# EAGLE design picostepseq_mk2_16a (EAGLE 9.6.2)
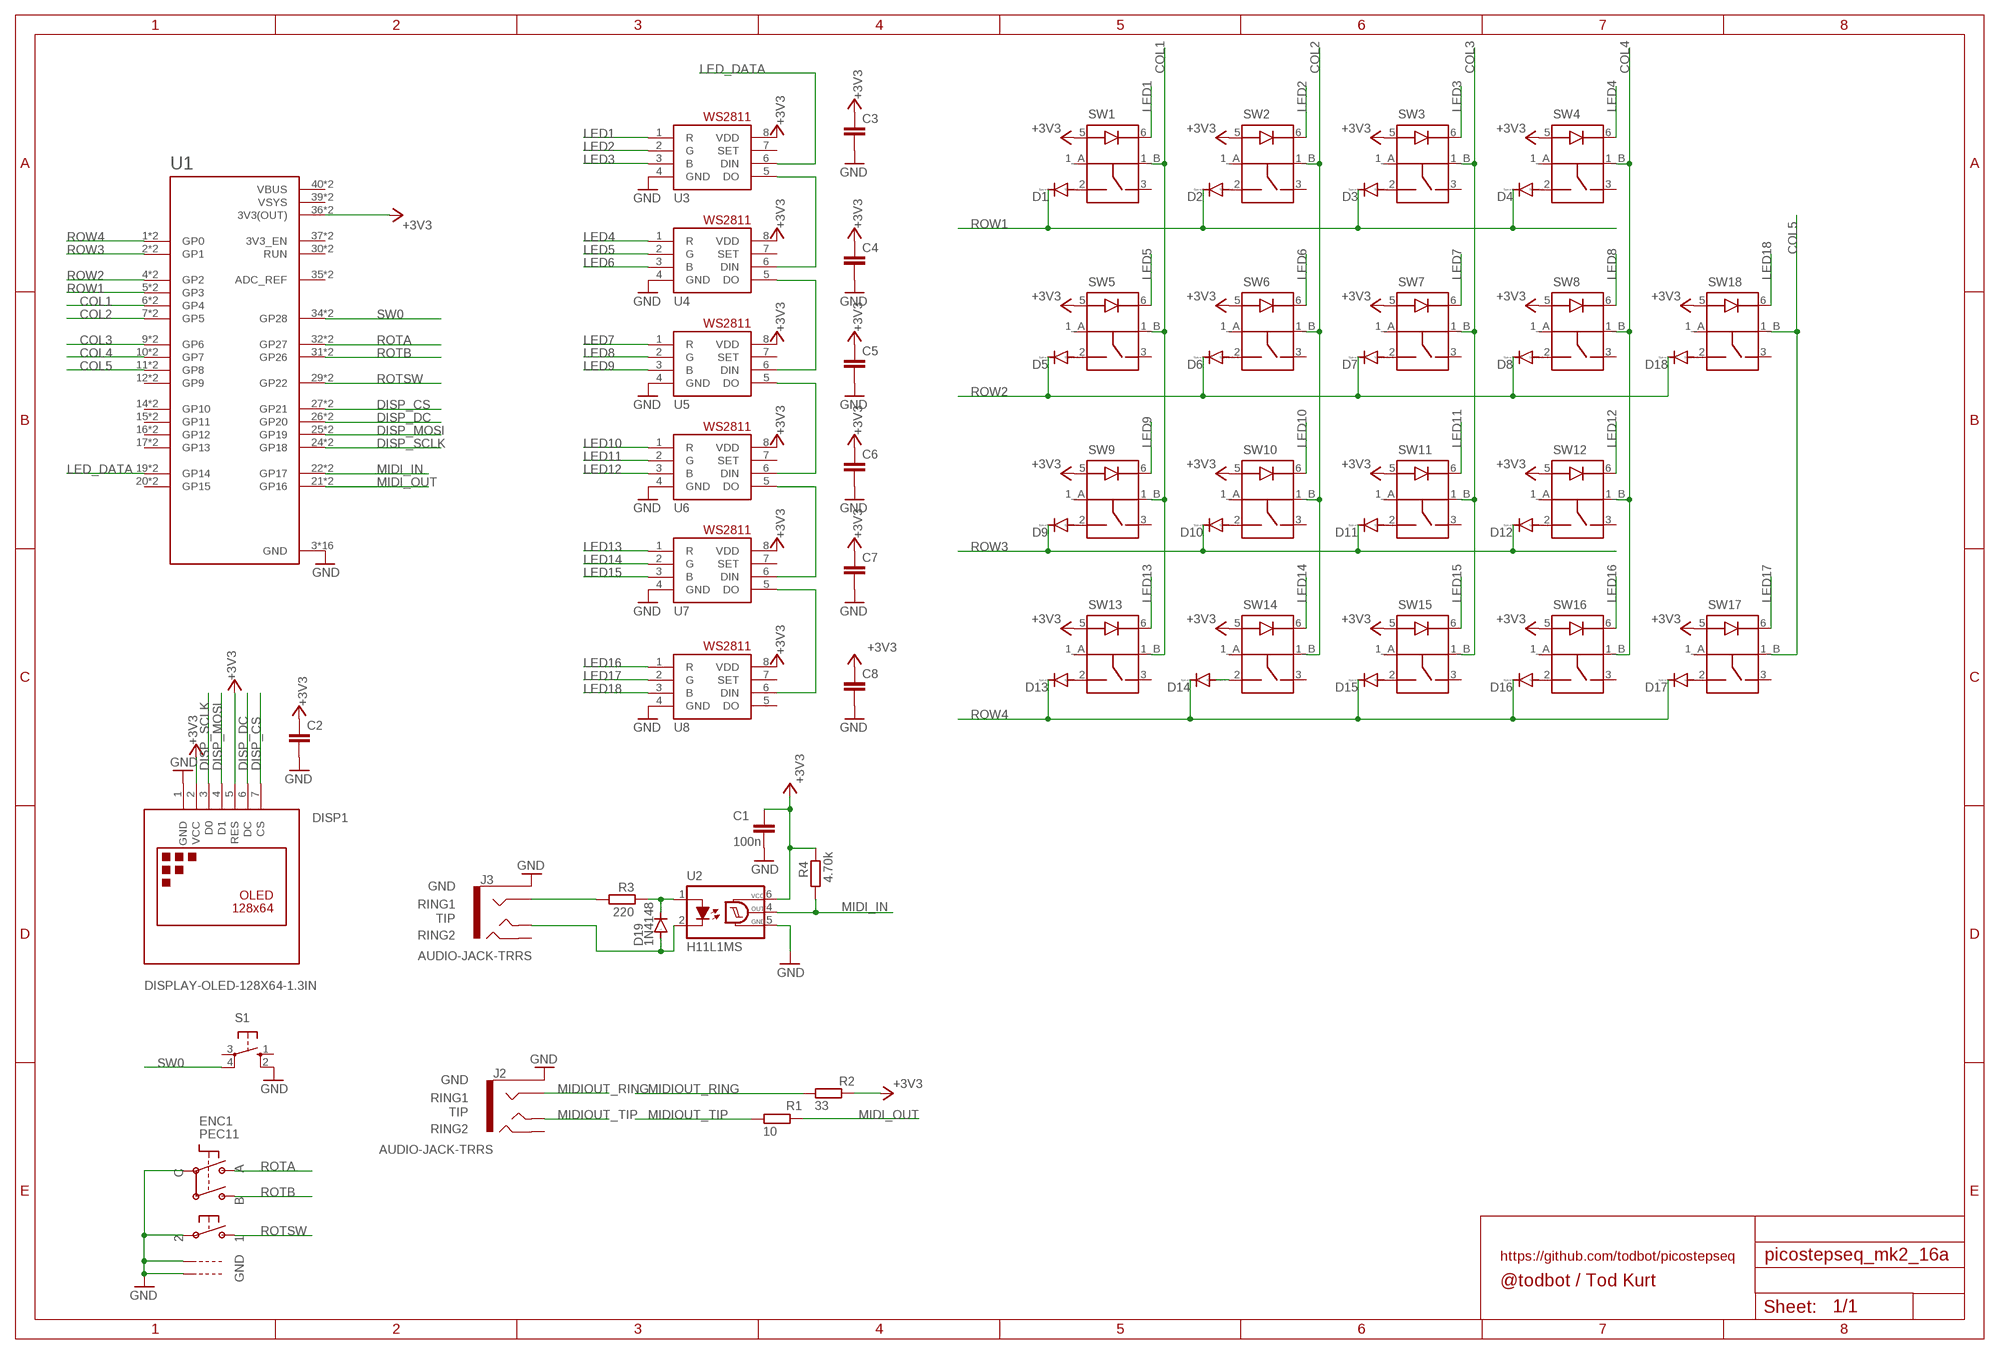
[diagram p0: schematic, sheet 1]

## Parts
C1  100n  C-EUC0805  [C0805]
C2  C-EUC0805  [C0805]
C3  C-EUC0805  [C0805]
C4  C-EUC0805  [C0805]
C5  C-EUC0805  [C0805]
C6  C-EUC0805  [C0805]
C7  C-EUC0805  [C0805]
C8  C-EUC0805  [C0805]
D1  DIODE-SOD123  [SOD123]
D2  DIODE-SOD123  [SOD123]
D3  DIODE-SOD123  [SOD123]
D4  DIODE-SOD123  [SOD123]
D5  DIODE-SOD123  [SOD123]
D6  DIODE-SOD123  [SOD123]
D7  DIODE-SOD123  [SOD123]
D8  DIODE-SOD123  [SOD123]
D9  DIODE-SOD123  [SOD123]
D10  DIODE-SOD123  [SOD123]
D11  DIODE-SOD123  [SOD123]
D12  DIODE-SOD123  [SOD123]
D13  DIODE-SOD123  [SOD123]
D14  DIODE-SOD123  [SOD123]
D15  DIODE-SOD123  [SOD123]
D16  DIODE-SOD123  [SOD123]
D17  DIODE-SOD123  [SOD123]
D18  DIODE-SOD123  [SOD123]
D19  1N4148  DIODE-SOD123  [SOD123]
DISP1  DISPLAY-OLED-128X64-1.3IN  [DISPLAY-OLED-128X64-1.3IN]
ENC1  PEC11  ENCODER_PLUS_SWITCH_BOURNS_PEC11  [PEC11+SWITCH]
J2  AUDIO-JACK-TRRS  [PJ-320D_SPARKFUN]
J3  AUDIO-JACK-TRRS  [PJ-320D_SPARKFUN]
R1  10  R-EU_R0805  [R0805]
R2  33  R-EU_R0805  [R0805]
R3  220  R-EU_R0805  [R0805]
R4  4.70k  R-EU_R0805  [R0805]
S1  10-XX  [B3F-10XX]
SW1  LED_SWITCHSTEP  [LED_SWITCH_STEP]
SW2  LED_SWITCHSTEP  [LED_SWITCH_STEP]
SW3  LED_SWITCHSTEP  [LED_SWITCH_STEP]
SW4  LED_SWITCHSTEP  [LED_SWITCH_STEP]
SW5  LED_SWITCHSTEP  [LED_SWITCH_STEP]
SW6  LED_SWITCHSTEP  [LED_SWITCH_STEP]
SW7  LED_SWITCHSTEP  [LED_SWITCH_STEP]
SW8  LED_SWITCHSTEP  [LED_SWITCH_STEP]
SW9  LED_SWITCHSTEP  [LED_SWITCH_STEP]
SW10  LED_SWITCHSTEP  [LED_SWITCH_STEP]
SW11  LED_SWITCHSTEP  [LED_SWITCH_STEP]
SW12  LED_SWITCHSTEP  [LED_SWITCH_STEP]
SW13  LED_SWITCHSTEP  [LED_SWITCH_STEP]
SW14  LED_SWITCHSTEP  [LED_SWITCH_STEP]
SW15  LED_SWITCHSTEP  [LED_SWITCH_STEP]
SW16  LED_SWITCHSTEP  [LED_SWITCH_STEP]
SW17  LED_SWITCHSTEP  [LED_SWITCH_STEP]
SW18  LED_SWITCHSTEP  [LED_SWITCH_STEP]
U1  RASPBERRY_PICO-NO_DEBUG  [PICO-PKG-NO_DEBUG]
U2  H11L1MS  [DIL6-SMD]
U3  WS2811-SOP8  [SO08-SKINNYPADS]
U4  WS2811-SOP8  [SO08-SKINNYPADS]
U5  WS2811-SOP8  [SO08-SKINNYPADS]
U6  WS2811-SOP8  [SO08-SKINNYPADS]
U7  WS2811-SOP8  [SO08-SKINNYPADS]
U8  WS2811-SOP8  [SO08-SKINNYPADS]

## Nets
+3V3: C1.1 C2.1 C3.1 C4.1 C5.1 C6.1 C7.1 C8.1 DISP1.2(VCC) DISP1.5(RES) R2.2 R4.1 SW1.5 SW2.5 SW3.5 SW4.5 SW5.5 SW6.5 SW7.5 SW8.5 SW9.5 SW10.5 SW11.5 SW12.5 SW13.5 SW14.5 SW15.5 SW16.5 SW17.5 SW18.5 U1.36(3V3(OUT)) U1.P$36(3V3(OUT)) U2.6(VCC) U3.8(VDD) U4.8(VDD) U5.8(VDD) U6.8(VDD) U7.8(VDD) U8.8(VDD)
COL1: SW1.1_B SW5.1_B SW9.1_B SW13.1_B U1.6(GP4) U1.P$6(GP4)
COL2: SW2.1_B SW6.1_B SW10.1_B SW14.1_B U1.7(GP5) U1.P$7(GP5)
COL3: SW3.1_B SW7.1_B SW11.1_B SW15.1_B U1.9(GP6) U1.P$9(GP6)
COL4: SW4.1_B SW8.1_B SW12.1_B SW16.1_B U1.10(GP7) U1.P$10(GP7)
COL5: SW17.1_B SW18.1_B U1.11(GP8) U1.P$11(GP8)
DISP_CS: DISP1.7(CS) U1.27(GP21) U1.P$27(GP21)
DISP_DC: DISP1.6(DC) U1.26(GP20) U1.P$26(GP20)
DISP_MOSI: DISP1.4(D1) U1.25(GP19) U1.P$25(GP19)
DISP_SCLK: DISP1.3(D0) U1.24(GP18) U1.P$24(GP18)
GND: C1.2 C2.2 C3.2 C4.2 C5.2 C6.2 C7.2 C8.2 DISP1.1(GND) ENC1.P$2 ENC1.P$C ENC1.P$GND1 ENC1.P$GND2 J2.EARTH J3.EARTH S1.2(S1) U1.3(GND) U1.8(GND) U1.13(GND) U1.18(GND) U1.23(GND) U1.28(GND) U1.33(GND) U1.38(GND) U1.P$3(GND) U1.P$8(GND) U1.P$13(GND) U1.P$18(GND) U1.P$23(GND) U1.P$28(GND) U1.P$33(GND) U1.P$38(GND) U2.5(GND) U3.4(GND) U4.4(GND) U5.4(GND) U6.4(GND) U7.4(GND) U8.4(GND)
LED1: SW1.6 U3.1(R)
LED2: SW2.6 U3.2(G)
LED3: SW3.6 U3.3(B)
LED4: SW4.6 U4.1(R)
LED5: SW5.6 U4.2(G)
LED6: SW6.6 U4.3(B)
LED7: SW7.6 U5.1(R)
LED8: SW8.6 U5.2(G)
LED9: SW9.6 U5.3(B)
LED10: SW10.6 U6.1(R)
LED11: SW11.6 U6.2(G)
LED12: SW12.6 U6.3(B)
LED13: SW13.6 U7.1(R)
LED14: SW14.6 U7.2(G)
LED15: SW15.6 U7.3(B)
LED16: SW16.6 U8.1(R)
LED17: SW17.6 U8.2(G)
LED18: SW18.6 U8.3(B)
LED_DATA: U1.19(GP14) U1.P$19(GP14) U3.6(DIN)
MIDI_IN: R4.2 U1.22(GP17) U1.P$22(GP17) U2.4(OUT)
MIDI_OUT: R1.2 U1.21(GP16) U1.P$21(GP16)
MIDIOUT_RING: J2.RING1 R2.1
MIDIOUT_TIP: J2.TIP R1.1
N$1: D18.A SW18.2
N$2: D17.A SW17.2
N$3: D1.A SW1.2
N$5: D2.A SW2.2
N$6: D3.A SW3.2
N$7: D4.A SW4.2
N$8: D5.A SW5.2
N$9: D9.A SW9.2
N$10: D10.A SW10.2
N$11: D11.A SW11.2
N$12: D12.A SW12.2
N$15: D13.A SW13.2
N$16: D14.A SW14.2
N$17: D15.A SW15.2
N$18: D16.A SW16.2
N$20: D6.A SW6.2
N$22: U3.5(DO) U4.6(DIN)
N$23: U4.5(DO) U5.6(DIN)
N$24: D7.A SW7.2
N$25: U5.5(DO) U6.6(DIN)
N$26: U6.5(DO) U7.6(DIN)
N$27: U7.5(DO) U8.6(DIN)
N$28: D8.A SW8.2
N$29: D19.C R3.1 U2.1(A)
N$30: D19.A J3.TIP U2.2(C)
N$31: J3.RING1 R3.2
ROTA: ENC1.P$A U1.32(GP27) U1.P$32(GP27)
ROTB: ENC1.P$B U1.31(GP26) U1.P$31(GP26)
ROTSW: ENC1.P$1 U1.29(GP22) U1.P$29(GP22)
ROW1: D1.C D2.C D3.C D4.C U1.5(GP3) U1.P$5(GP3)
ROW2: D5.C D6.C D7.C D8.C D18.C U1.4(GP2) U1.P$4(GP2)
ROW3: D9.C D10.C D11.C D12.C U1.2(GP1) U1.P$2(GP1)
ROW4: D13.C D14.C D15.C D16.C D17.C U1.1(GP0) U1.P$1(GP0)
SW0: S1.4(P1) U1.34(GP28) U1.P$34(GP28)
Unconnected: J2.RING2 J3.RING2 S1.1(S) S1.3(P) SW1.1_A SW1.3 SW2.1_A SW2.3 SW3.1_A SW3.3 SW4.1_A SW4.3 SW5.1_A SW5.3 SW6.1_A SW6.3 SW7.1_A SW7.3 SW8.1_A SW8.3 SW9.1_A SW9.3 SW10.1_A SW10.3 SW11.1_A SW11.3 SW12.1_A SW12.3 SW13.1_A SW13.3 SW14.1_A SW14.3 SW15.1_A SW15.3 SW16.1_A SW16.3 SW17.1_A SW17.3 SW18.1_A SW18.3 U1.12(GP9) U1.14(GP10) U1.15(GP11) U1.16(GP12) U1.17(GP13) U1.20(GP15) U1.30(RUN) U1.35(ADC_REF) U1.37(3V3_EN) U1.P$12(GP9) U1.P$14(GP10) U1.P$15(GP11) U1.P$16(GP12) U1.P$17(GP13) U1.P$20(GP15) U1.P$30(RUN) U1.P$35(ADC_REF) U1.P$37(3V3_EN) U3.7(SET) U4.7(SET) U5.7(SET) U6.7(SET) U7.7(SET) U8.5(DO) U8.7(SET)

## Notes on the sheet
- GND
- RING1
- TIP
- RING2
- GND
- RING1
- TIP
- RING2
- https://github.com/todbot/picostepseq
- @todbot / Tod Kurt

## Power pins joined to a net without a drawn wire
VBUS: U1.40(VBUS) U1.P$40(VBUS)
VSYS: U1.39(VSYS) U1.P$39(VSYS)

## Library data of the parts
C1-C8 = rcl:C-EU: CAPACITOR, European symbol; SPICEPREFIX: C
D1-D19 = diode:DIODE-: DIODE
DISP1 = todstuff:DISPLAY-OLED-128X64: 128x64 Dot Matrix OLED Module based on SSD1306 chip Variant with SPI interface More details available here: http://www.instructables.com/id/How-to-use-OLED-display-arduino-module/ SSD1306 datasheet: https://cdn-shop.adafruit.com/datasheets/SSD1306.pdf Click here to find device on ebay.com <http://www.ebay.com/sch/oled+display+128x64> Note: There are two variants: I2C and SPI. Search for the proper version.
ENC1 = adafruit_electromech:ENCODER_PLUS_SWITCH: Rotary Encoder with Built-In Switch PEC11 - 24 Step, PEC11-4215F-S24 - http://www.adafruit.com/products/377
J2 J3 = audio_jacks_todbot:AUDIO-JACK-TRRS; LCSC: C431535; MPN: PJ-320D
R1-R4 = rcl:R-EU_: RESISTOR, European symbol; SPICEPREFIX: R
S1 = switch-omron:10-XX: OMRON SWITCH; MPN: B3F-1000; OC_FARNELL: 176432; OC_NEWARK: 36M3542
SW1-SW18 = todstuff:LED_SWITCH: Step switch with LED, like on old drum machines https://www.adafruit.com/product/5519
U1 = RpiPico:RASPBERRY_PICO-NO_DEBUG
U2 = optocoupler:H11L*M: 6-Pin DIP Optocoupler Source: http://www.fairchildsemi.com/ds/H1/H11L2-M.pdf; LCSC: C78589; MPN2: H11L1S; OC_FARNELL: unknown; OC_NEWARK: unknown
U3-U8 = adafruit:WS2811

## Board
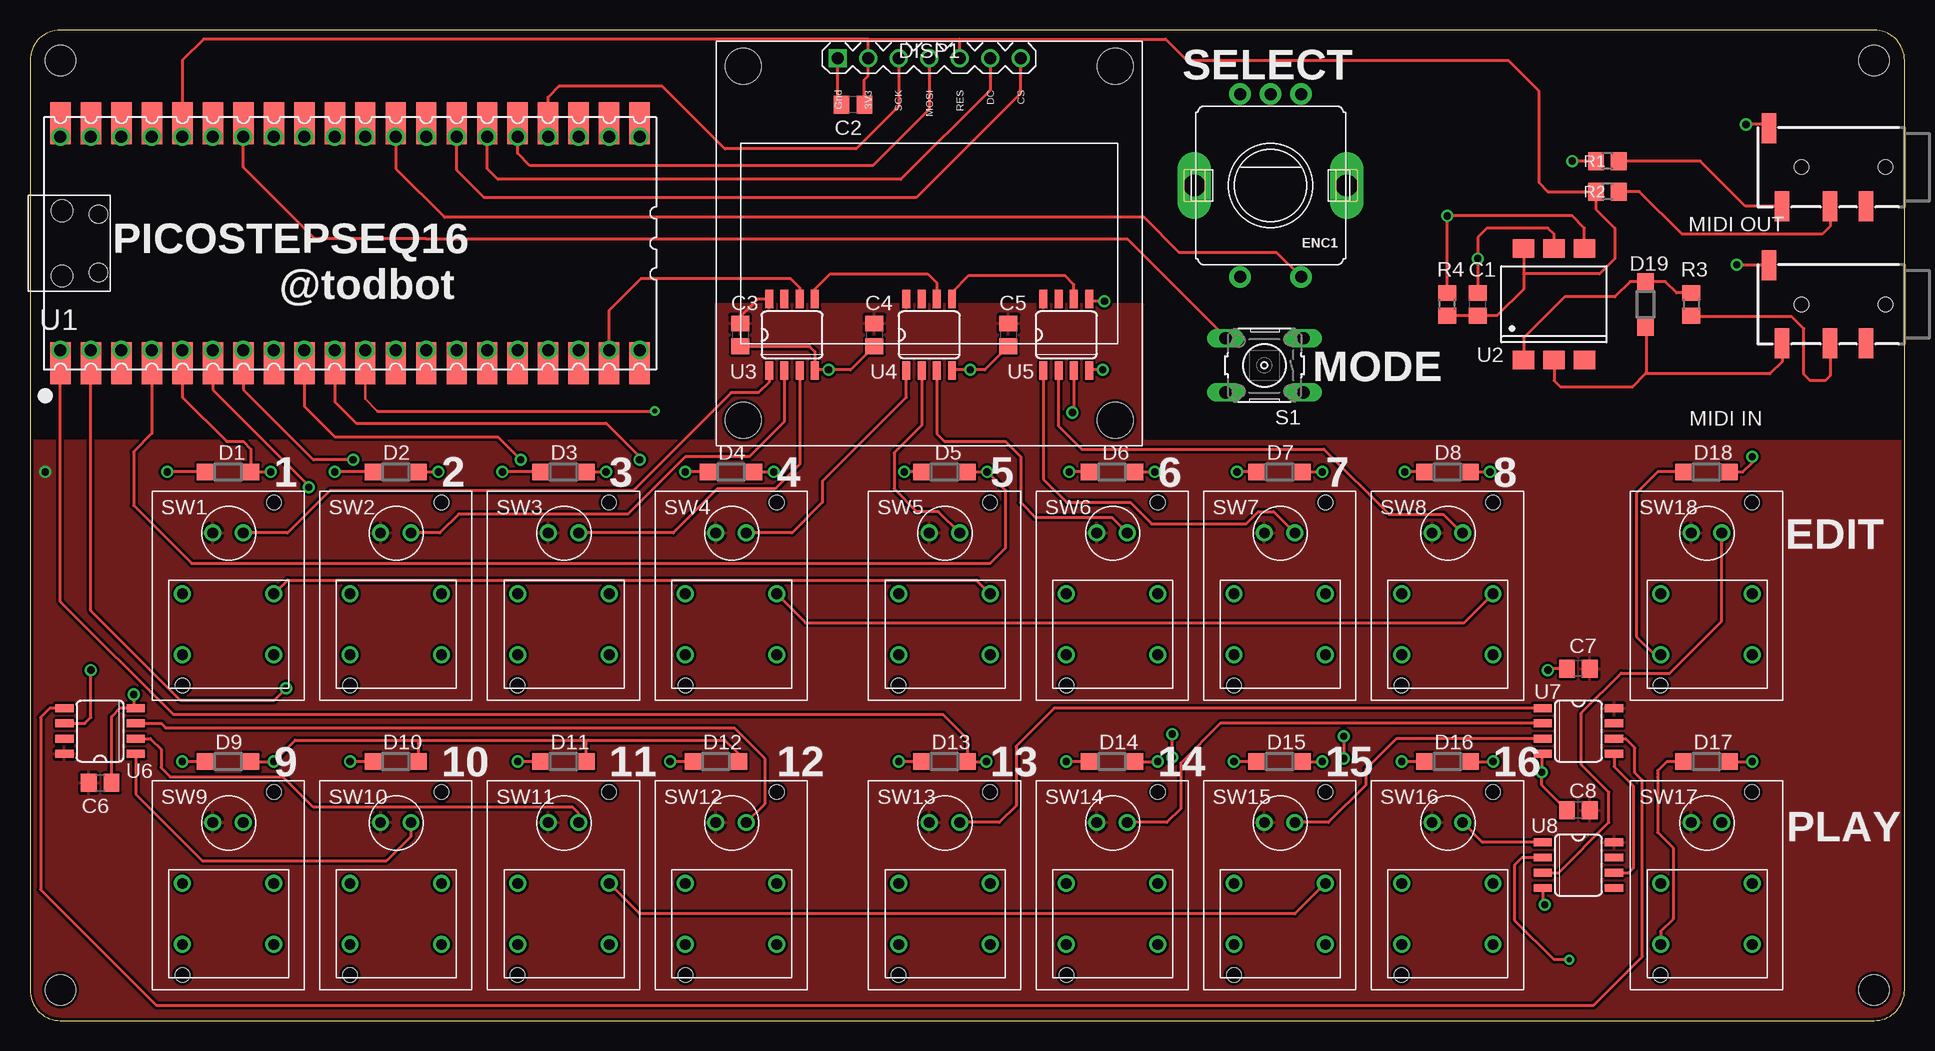
[diagram p1: board, top side]
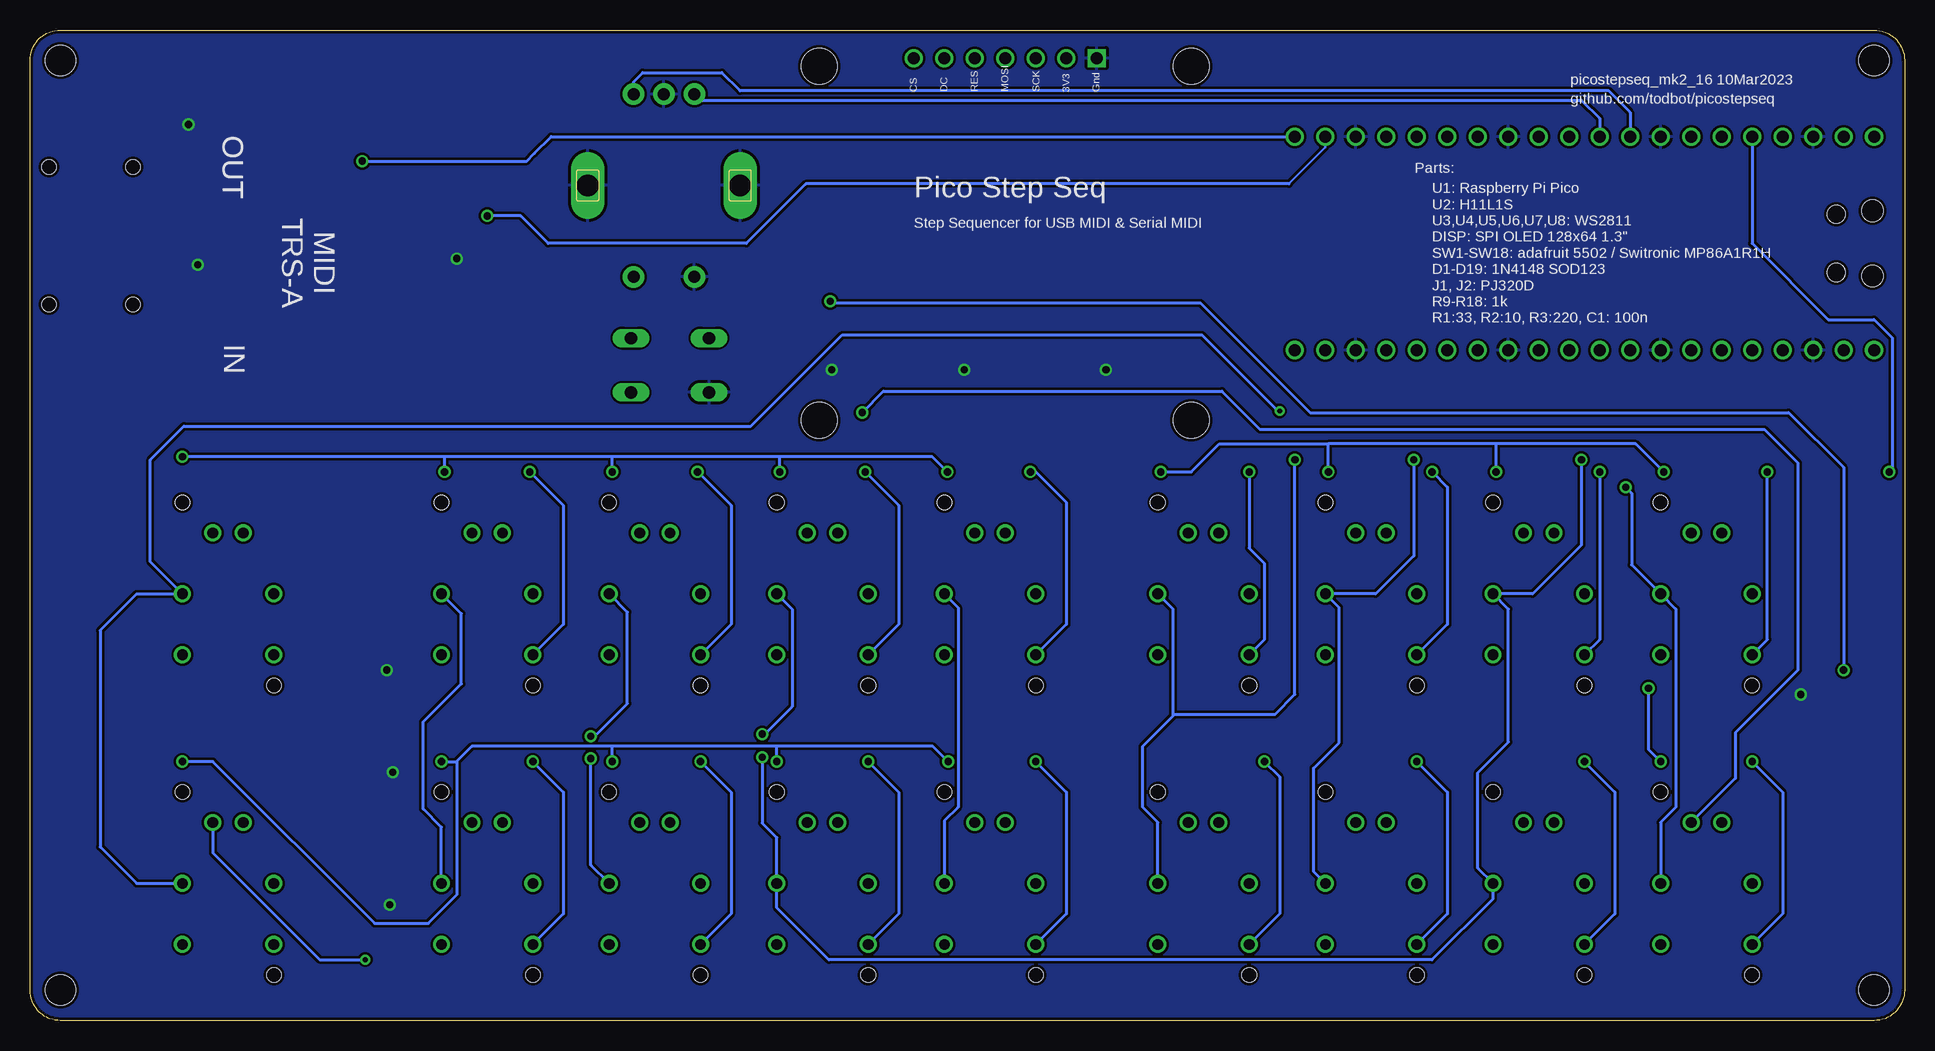
[diagram p2: board, bottom side, seen from below]

Size 156.21 x 82.55 mm. Coordinates in mm from the lower left corner, seen from the top.
Outline: 0,80.01 0,2.54 arc90 2.54,0 153.67,0 arc90 156.21,2.54 156.21,80.01 arc90 153.67,82.55 2.54,82.55 arc90 0,80.01
Copper layers (1*16): Top 0.035mm / dielectric 1.5mm / Bottom 0.035mm
Design rules "adafruit-rules-20180530": minimum track width 8mil, minimum drill 16mil, track to track 8mil, track to pad 8mil, pad to pad 8mil, via to via 8mil, smd to smd 8mil, copper to edge 10mil, drill to drill 8mil, minimum pad ring 10mil, minimum via ring 8mil, stop-mask expansion 4mil, vias tented up to drill 20mil, thermal gap 10mil
Holes 2.54 mm at 2.54,2.54 153.67,2.54 153.67,80.01 2.54,80.01

### Footprints (pad centres in the part's own frame; a part is rotated, then mirrored left to right if it is on the bottom)
C0805 = smd 1.3 x 1.5: 1 -0.95,0; 2 0.95,0
SOD123 = smd 1.4 x 1.4: A 1.9,0; C -1.9,0
DISPLAY-OLED-128X64-1.3IN = drill 1 square: 1 -7.62,15.43 | drill 1: 2 -5.08,15.43; 3 -2.54,15.43; 4 0,15.43; 5 2.54,15.43; 6 5.08,15.43; 7 7.62,15.43 | hole 3: -15.5,14.75; 15.5,14.75; 15.5,-14.75; -15.5,-14.75
PEC11+SWITCH = drill 1 pad 1.8: P$1 -2.54,7.62; P$2 2.54,7.62; P$A -2.54,-7.62; P$B 2.54,-7.62; P$C 0,-7.62 | drill 1.8 pad 2.8 long: P$GND1 -6.35,0; P$GND2 6.35,0
PJ-320D_SPARKFUN = smd 1.2 x 2.5: EARTH 11.3,-3.25; RING1 6.2,3.25; RING2 3.2,3.25; TIP 10.2,3.25 | hole 1.2: 1.6,0; 8.6,0
R0805 = smd 1.3 x 1.5: 1 -0.95,0; 2 0.95,0
B3F-10XX = drill 1.016 long: 1 -3.251,2.261; 2 3.251,2.261; 3 -3.251,-2.261; 4 3.251,-2.261
LED_SWITCH_STEP = drill 0.9: 1_A -3.81,0; 1_B 3.81,0; 2 -3.81,-5.08; 3 3.81,-5.08; 5 -1.27,5.08; 6 1.27,5.08 | hole 1.2: -3.81,-7.62; 3.81,7.62
PICO-PKG-NO_DEBUG = drill 1: 1 -7.62,25.4; 2 -7.62,22.86; 3 -7.62,20.32; 4 -7.62,17.78; 5 -7.62,15.24; 6 -7.62,12.7; 7 -7.62,10.16; 8 -7.62,7.62; 9 -7.62,5.08; 10 -7.62,2.54; 11 -7.62,0; 12 -7.62,-2.54; 13 -7.62,-5.08; 14 -7.62,-7.62; 15 -7.62,-10.16; 16 -7.62,-12.7; 17 -7.62,-15.24; 18 -7.62,-17.78; 19 -7.62,-20.32; 20 -7.62,-22.86; 21 10.16,-22.86; 22 10.16,-20.32; 23 10.16,-17.78; 24 10.16,-15.24; 25 10.16,-12.7; 26 10.16,-10.16; 27 10.16,-7.62; 28 10.16,-5.08; 29 10.16,-2.54; 30 10.16,0; 31 10.16,2.54; 32 10.16,5.08; 33 10.16,7.62; 34 10.16,10.16; 35 10.16,12.7; 36 10.16,15.24; 37 10.16,17.78; 38 10.16,20.32; 39 10.16,22.86; 40 10.16,25.4 | smd 3.5 x 1.7: P$1 -8.73,25.4; P$2 -8.73,22.86; P$3 -8.73,20.32; P$4 -8.73,17.78; P$5 -8.73,15.24; P$6 -8.73,12.7; P$7 -8.73,10.16; P$8 -8.73,7.62; P$9 -8.73,5.08; P$10 -8.73,2.54; P$11 -8.73,0; P$12 -8.73,-2.54; P$13 -8.73,-5.08; P$14 -8.73,-7.62; P$15 -8.73,-10.16; P$16 -8.73,-12.7; P$17 -8.73,-15.24; P$18 -8.73,-17.78; P$19 -8.73,-20.32; P$20 -8.73,-22.86; P$21 11.27,-22.86; P$22 11.27,-20.32; P$23 11.27,-17.78; P$24 11.27,-15.24; P$25 11.27,-12.7; P$26 11.27,-10.16; P$27 11.27,-7.62; P$28 11.27,-5.08; P$29 11.27,-2.54; P$30 11.27,0; P$31 11.27,2.54; P$32 11.27,5.08; P$33 11.27,7.62; P$34 11.27,10.16; P$35 11.27,12.7; P$36 11.27,15.24; P$37 11.27,17.78; P$38 11.27,20.32; P$39 11.27,22.86; P$40 11.27,25.4 | hole 1.8: -1.455,25.27; 3.995,25.27 | hole 1.5: -1.155,22.24; 3.695,22.24
DIL6-SMD = smd 1.78 x 1.52: 1 -2.54,-4.645; 2 0,-4.645; 3 2.54,-4.645; 4 2.54,4.645; 5 0,4.645; 6 -2.54,4.645
SO08-SKINNYPADS = smd 0.66 x 1.524: 1 -1.905,-2.973; 2 -0.635,-2.973; 3 0.635,-2.973; 4 1.905,-2.973; 5 1.905,2.973; 6 0.635,2.973; 7 -0.635,2.973; 8 -1.905,2.973

### Placement (x,y rotation side)
C1  120.65,59.69 90 top
C2  68.58,76.33 180 top
C3  59.18,57.15 270 top
C4  70.36,57.15 270 top
C5  81.53,57.15 270 top
C6  5.84,19.81 0 top
C7  129.03,29.34 180 top
C8  129.03,17.53 180 top
D1  16.51,45.72 180 top
D2  30.48,45.72 180 top
D3  44.45,45.72 180 top
D4  58.42,45.72 180 top
D5  76.2,45.72 180 top
D6  90.17,45.72 180 top
D7  104.14,45.72 180 top
D8  118.11,45.72 180 top
D9  16.51,21.59 180 top
D10  30.48,21.59 180 top
D11  44.45,21.59 180 top
D12  57.15,21.59 180 top
D13  76.2,21.59 180 top
D14  90.17,21.59 180 top
D15  104.14,21.59 180 top
D16  118.11,21.59 180 top
D17  139.7,21.59 180 top
D18  139.7,45.72 180 top
D19  134.62,59.69 270 top
DISP1  74.93,64.77 0 top
ENC1  103.38,69.6 180 top
J2  156.21,71.12 180 top
J3  156.21,59.69 180 top
R1  131.44,71.63 180 top
R2  131.44,69.09 180 top
R3  138.43,59.69 270 top
R4  118.11,59.69 90 top
S1  102.87,54.61 180 top
SW1  16.51,35.56 0 top
SW2  30.48,35.56 0 top
SW3  44.45,35.56 0 top
SW4  58.42,35.56 0 top
SW5  76.2,35.56 0 top
SW6  90.17,35.56 0 top
SW7  104.14,35.56 0 top
SW8  118.11,35.56 0 top
SW9  16.51,11.43 0 top
SW10  30.48,11.43 0 top
SW11  44.45,11.43 0 top
SW12  58.42,11.43 0 top
SW13  76.2,11.43 0 top
SW14  90.17,11.43 0 top
SW15  104.14,11.43 0 top
SW16  118.11,11.43 0 top
SW17  139.7,11.43 0 top
SW18  139.7,35.56 0 top
U1  27.94,63.5 90 top
U2  127,59.69 0 top
U3  63.5,57.15 0 top
U4  74.93,57.15 0 top
U5  86.36,57.15 0 top
U6  5.84,24.13 90 top
U7  129.03,24.13 270 top
U8  129.03,12.95 270 top

### Tracks (layer width: path | path; a pad name or v marks a point on that pad's centre or on a via)
+3V3  (via drill 0.6)
  Top 0.254: U3.8 60.63,60.12 59.18,58.67 C3.1 | C2.1 69.53,78.42 69.85,78.74 DISP1.2 69.85,81.79 | 69.85,81.79 14.48,81.79 12.7,80.01 U1.36 U1.P$36 | R4.1 C1.1 122.24,58.74 124.46,60.96 124.46,62.23 | U2.6 124.46,62.23 | 124.46,62.23 130.81,62.23 132.08,63.5 132.08,66.04 130.5,67.62 R2.2 126.49,69.09 125.73,69.85 125.73,77.47 123.19,80.01 96.41,80.01 94.63,81.79 77.47,81.79 | 69.85,81.79 77.47,81.79 | DISP1.5 77.47,81.79
  Bottom 0.254: U1.36 12.7,64.77 6.35,58.42 2.54,58.42 1.02,56.9 1.02,45.97 v1.27,45.72
  pour Top: 156.47,48.34 156.47,0.25 -4.21,0.25 -4.21,48.34 57.15,48.34 57.15,59.69 92.71,59.69 92.71,48.26
COL1  (via drill 0.6)
  Top 0.254: SW1.1_B 21.46,36.7 78.87,36.7 SW5.1_B | U1.6 U1.P$6 15.24,52.58 23.24,44.58 v23.24,44.45
  Bottom 0.254: SW9.1_B 20.32,16.51 19.05,17.78 19.05,34.29 SW1.1_B 22.73,37.97 22.73,43.94 v23.24,44.45 | SW5.1_B 78.87,34.42 78.87,17.78 80.01,16.64 SW13.1_B
COL2  (via drill 0.6)
  Top 0.254: U1.7 U1.P$7 17.78,52.58 23.62,46.74 v26.92,46.74 | v95.19,21.95 v95.19,23.88
  Bottom 0.254: SW6.1_B 92.71,34.29 92.71,26.16 95,23.88 v95.19,23.88 | v26.92,46.74 26.92,39.62 30.99,35.56 SW2.1_B 33.02,34.29 33.02,23.21 35.56,20.67 35.56,12.7 SW10.1_B 34.29,10.16 39.39,5.06 89.64,5.06 93.98,9.4 SW14.1_B 93.98,15.24 95.19,16.45 v95.19,21.95
COL3  (via drill 0.6)
  Top 0.254: SW15.1_B 105.41,8.89 50.8,8.89 SW11.1_B | U1.9 U1.P$9 22.86,51.18 25.4,48.64 38.99,48.64 v40.89,46.74 | v109.47,23.69 v109.47,21.84
  Bottom 0.254: SW11.1_B 49.24,12.41 49.24,21.05 47.12,23.17 47.12,34.42 SW3.1_B 44.07,35.56 40.89,38.73 v40.89,46.74 | SW7.1_B 106.43,34.04 106.43,26.42 109.15,23.69 v109.47,23.69 | SW15.1_B 109.47,12.95 v109.47,21.84
COL4  (via drill 0.6)
  Top 0.254: SW4.1_B 64.64,33.15 119.51,33.15 SW8.1_B | U1.10 U1.P$10 25.4,51.56 27.18,49.78 48.01,49.78 50.8,46.99 v50.8,46.74 | v50.8,46.74
  Bottom 0.254: SW12.1_B 62.23,16.51 63.5,17.78 63.5,22.86 60.96,25.4 | SW4.1_B 60.96,34.29 60.96,25.4 | SW16.1_B 121.92,16.13 123.44,17.65 123.44,24.89 120.27,28.07 120.27,33.91 SW8.1_B | 60.96,25.4 60.83,25.53 52.45,25.53 50.8,27.18 v50.8,46.74
COL5  (via drill 0.41)
  Top 0.203: 28.96,50.8 27.94,51.82 U1.P$11
  Top 0.254: U1.P$11 U1.11 | 28.96,50.8 v52.07,50.8
  Bottom 0.254: SW17.1_B 147.32,11.43 150.37,14.48 150.37,32.51 147.32,35.56 SW18.1_B 146.18,38.23 146.18,46.74 143.38,49.53 96.14,49.53 88.52,57.15 58.55,57.15 52.2,50.8 v52.07,50.8
DISP_CS
  Top 0.254: DISP1.7 82.55,77.28 73.85,68.58 37.85,68.58 35.56,70.87 U1.27 U1.P$27
DISP_DC
  Top 0.203: U1.P$26 U1.26
  Top 0.254: DISP1.6 80.01,77.53 72.58,70.1 38.99,70.1 38.1,70.99 U1.P$26
DISP_MOSI
  Top 0.254: DISP1.4 74.93,75.95 70.23,71.25 41.66,71.25 40.64,72.26 U1.25 U1.P$25
DISP_SCLK
  Top 0.203: U1.P$24 U1.24
  Top 0.254: DISP1.3 72.39,76.2 68.83,72.64 57.91,72.64 52.7,77.85 44.07,77.85 43.18,76.96 U1.P$24
GND  (via drill 0.6)
  Top 0.203: U1.P$23 U1.23
  Top 0.254: U1.P$3 U1.3 | U1.P$8 U1.8 | U1.P$13 U1.13 | U1.P$18 U1.18 | U1.P$33 U1.33 | U1.P$38 U1.38 | U1.P$28 U1.28 | U4.4 76.89,54.23 v78.36,54.23 79.56,54.23 C5.2 | U5.4 88.32,54.23 v89.41,54.23 | U6.4 8.79,26.06 | 8.79,26.06 8.64,26.21 v8.64,27.18 | U7.4 125.98,22.15 v125.98,20.7 125.98,19.62 C8.2 | U8.4 126.06,9.83 v126.24,9.65 | C3.2 64.96,56.2 65.41,55.75 U3.4 65.46,54.23 v66.55,54.23 68.39,54.23 C4.2 | C2.2 67.31,76.65 DISP1.1 | C6.2 6.79,25.33 7.52,26.06 8.79,26.06 | C7.2 126.62,29.34 v126.49,29.21 | U2.5 127,65.53 126.49,66.04 121.41,66.04 120.65,65.28 v120.65,63.5 C1.2 | J3.EARTH 142.29,62.94 v142.24,62.99 | J2.EARTH 144.6,74.68 v143,74.68
  pour Bottom: 0,82.36 158.75,82.36 158.75,0.25 0,0.25
LED1
  Top 0.254: SW1.6 21.46,40.64 24.98,44.16 50.26,44.16 58.42,52.32 60.71,52.32 61.59,53.21 U3.1
LED2
  Top 0.254: SW2.6 34.16,40.64 35.72,42.2 49.82,42.2 54.61,46.99 59.94,46.99 62.87,49.91 U3.2
LED3
  Top 0.254: SW3.6 53.61,40.64 57.29,44.32 62.1,44.32 64.14,46.35 U3.3
LED4
  Top 0.254: SW4.6 63.5,40.64 66.04,43.18 66.04,44.96 73.03,51.94 U4.1
LED5
  Top 0.254: U4.2 74.3,49.6 72.01,47.32 72.01,44.32 73.91,42.42 75.69,42.42 SW5.6
LED6
  Top 0.254: U4.3 75.56,48.9 76.2,48.26 81.28,48.26 82.55,46.99 82.55,43.18 83.82,41.91 90.17,41.91 SW6.6
LED7
  Top 0.254: U5.1 84.45,45.11 86.39,43.18 91.69,43.18 93.47,41.4 101.35,41.4 102.36,42.42 103.63,42.42 SW7.6
LED8
  Top 0.254: SW8.6 119.32,40.64 117.78,42.18 113.27,42.18 107.82,47.63 87.63,47.63 85.72,49.54 U5.2
LED9  (via drill 0.6)
  Top 0.254: U5.3 87,50.8 v86.87,50.67
  Bottom 0.254: v86.87,50.67 85.09,52.45 56.9,52.45 53.72,49.28 11.68,49.28 8.89,46.48 8.89,29.21 14.1,24 14.1,20.19 SW9.6
LED10
  Top 0.254: U6.1 8.81,18.87 14.35,13.34 29.72,13.34 31.75,15.37 SW10.6
LED11
  Top 0.254: U6.2 10.03,23.5 10.92,22.61 10.92,21.08 11.68,20.32 21.08,20.32 23.62,17.78 45.21,17.78 45.72,17.27 SW11.6
LED12
  Top 0.254: U6.3 10.92,24.77 11.3,24.38 58.67,24.38 61.21,21.84 61.21,18.03 SW12.6
LED13
  Top 0.254: SW13.6 80.77,16.51 82.17,17.91 82.17,22.86 85.34,26.04 U7.1
LED14
  Top 0.254: U7.2 99.19,24.77 95.89,21.46 95.89,17.65 94.74,16.51 SW14.6
LED15
  Top 0.254: U7.3 113.87,23.5 111.33,20.95 111.33,19.63 108.2,16.51 SW15.6
LED16
  Top 0.254: U8.1 121.03,14.86 SW16.6
LED17  (via drill 0.41)
  Top 0.254: U8.2 124.33,13.59 123.7,12.95 123.7,8.38 127,5.08 v128.27,5.08
  Bottom 0.254: SW17.6 140.97,13.97 132.08,5.08 v128.27,5.08
LED18
  Top 0.254: U8.3 127.38,12.32 131.57,16.51 131.57,19.05 129.29,21.34 129.29,25.65 132.59,28.96 136.65,28.96 140.97,33.27 SW18.6
LED_DATA
  Top 0.254: U1.19 U1.P$19 48.26,59.18 50.93,61.85 63.37,61.85 64.14,61.09 U3.6
MIDI_IN  (via drill 0.6)
  Top 0.203: U1.P$22 U1.22
  Top 0.254: R4.2 v118.11,67.06 128.52,67.06 129.54,66.04 U2.4
  Bottom 0.203: 51.3,69.73 48.26,72.77 U1.22
  Bottom 0.254: 51.3,69.73 91.56,69.73 96.52,64.77 113.03,64.77 115.32,67.06 v118.11,67.06
MIDI_OUT  (via drill 0.6)
  Top 0.203: U1.P$21 U1.21
  Top 0.254: R1.2 v128.52,71.63
  Bottom 0.254: U1.21 112.78,73.66 114.17,72.26 114.81,71.63 v128.52,71.63
MIDIOUT_RING
  Top 0.254: R2.1 134.11,69.09 137.67,65.53 149.35,65.53 150.01,66.19 J2.RING1
MIDIOUT_TIP
  Top 0.254: J2.TIP 142.95,67.87 139.19,71.63 R1.1
N$1
  Top 0.254: D18.A 135.64,45.72 133.86,43.94 133.86,32 135.38,30.48 SW18.2
N$2
  Top 0.254: SW17.2 135.89,7.43 136.92,8.46 136.92,14.4 135.64,15.69 135.64,20.32 135.64,20.57 135.64,20.83 136.4,21.59 D17.A
N$3  (via drill 0.6)
  Top 0.254: D1.A v11.43,45.72
  Bottom 0.254: SW1.2 11.43,31.75 v11.43,45.72
N$5  (via drill 0.6)
  Top 0.254: D2.A v25.4,45.72
  Bottom 0.254: v25.4,45.72 25.4,31.75 SW2.2
N$6  (via drill 0.6)
  Top 0.254: D3.A v39.37,45.72
  Bottom 0.254: v39.37,45.72 38.1,44.45 38.1,33.02 SW3.2
N$7  (via drill 0.6)
  Top 0.254: D4.A v54.61,45.72
  Bottom 0.254: v54.61,45.72 54.61,39.37 53.34,38.1 53.34,31.75 SW4.2
N$8  (via drill 0.6)
  Top 0.254: D5.A v72.84,45.72
  Bottom 0.254: v72.84,45.72 72.39,45.72 69.85,43.18 69.85,33.02 SW5.2
N$9  (via drill 0.6)
  Top 0.254: D9.A v12.7,21.59
  Bottom 0.254: v12.7,21.59 10.16,19.05 10.16,8.89 SW9.2
N$10  (via drill 0.6)
  Top 0.254: D10.A v26.67,21.59
  Bottom 0.254: v26.67,21.59 24.13,19.05 24.13,8.89 SW10.2
N$11  (via drill 0.6)
  Top 0.254: D11.A v40.64,21.59
  Bottom 0.254: v40.64,21.59 38.1,19.05 38.1,8.89 SW11.2
N$12  (via drill 0.6)
  Top 0.254: D12.A v53.34,21.59
  Bottom 0.254: v53.34,21.59 52.07,20.32 52.07,8.89 SW12.2
N$15  (via drill 0.6)
  Top 0.254: D13.A v72.39,21.59
  Bottom 0.254: v72.39,21.59 69.85,19.05 69.85,8.89 SW13.2
N$16  (via drill 0.6)
  Top 0.254: D14.A v86.36,21.59
  Bottom 0.254: v86.36,21.59 83.82,19.05 83.82,8.89 SW14.2
N$17  (via drill 0.6)
  Top 0.254: D15.A v100.33,21.59
  Bottom 0.254: v100.33,21.59 97.79,19.05 97.79,8.89 SW15.2
N$18  (via drill 0.6)
  Top 0.254: D16.A v114.3,21.59
  Bottom 0.254: v114.3,21.59 111.76,19.05 111.76,8.89 SW16.2
N$20  (via drill 0.6)
  Top 0.254: D6.A v86.61,45.72
  Bottom 0.254: v86.61,45.72 83.82,42.93 83.82,33.02 SW6.2
N$22
  Top 0.254: U3.5 65.41,60.96 66.67,62.23 74.8,62.23 75.56,61.47 U4.6
N$23
  Top 0.254: U5.6 87,61.34 86.23,62.1 78.23,62.1 76.83,60.71 U4.5
N$24  (via drill 0.6)
  Top 0.254: D7.A v100.58,45.72
  Bottom 0.254: v100.58,45.72 97.79,42.93 97.79,33.02 SW7.2
N$25  (via drill 0.6)
  Top 0.254: U6.6 4.57,24.77 5.08,25.27 v5.08,29.21 | U5.5 88.27,59.94 v89.53,59.94
  Bottom 0.254: v89.53,59.94 89.53,59.82 61.72,59.82 | 61.72,59.82 58.67,59.82 49.53,50.67 9.65,50.67 5.08,46.1 v5.08,29.21 | 61.72,59.82
N$26
  Top 0.254: U6.5 1.65,26.04 0.89,25.27 0.89,10.92 10.54,1.27 130.3,1.27 134.37,5.33 134.37,20.04 133.73,20.67 133.73,22.73 132.97,23.5 U7.6
N$27
  Top 0.254: U8.6 133.22,12.32 133.6,12.7 133.6,19.56 132,21.16 U7.5
N$28  (via drill 0.6)
  Top 0.254: D8.A v114.55,45.72
  Bottom 0.254: v114.55,45.72 111.76,42.93 111.76,33.02 SW8.2
N$29
  Top 0.254: R3.1 137.23,60.64 136.28,61.59 D19.C 133.35,61.59 132.08,60.32 127.88,60.32 124.46,56.9 U2.1
N$30
  Top 0.254: J3.TIP 146.01,54.92 144.99,53.9 134.62,53.9 | U2.2 127,53.34 127.51,52.83 133.55,52.83 134.62,53.9 | D19.A 134.67,57.74 134.67,53.95 134.62,53.9
N$31
  Top 0.254: J3.RING1 150.01,53.74 149.61,53.34 148.34,53.34 147.83,53.85 147.83,57.66 146.81,58.67 138.5,58.67 R3.2
ROTA
  Top 0.254: U1.P$32 U1.32
  Bottom 0.254: U1.32 22.86,75.69 24.64,77.47 97.03,77.47 98.55,78.99 105.16,78.99 105.92,78.23 ENC1.P$A
ROTB
  Top 0.254: U1.P$31 U1.31
  Bottom 0.254: ENC1.P$B 100.33,76.71 26.92,76.71 25.4,75.18 U1.31
ROTSW
  Top 0.203: U1.P$29 U1.29
  Top 0.254: ENC1.P$1 103.89,64.01 95.76,64.01 92.84,66.93 34.54,66.93 30.48,70.99 U1.P$29
ROW1  (via drill 0.6)
  Top 0.254: U1.5 U1.P$5 12.7,51.94 16.38,48.26 17.78,48.26 18.41,47.63 D1.C v20.07,45.72 | D2.C v34.04,45.72 | D3.C v48.01,45.72 | D4.C v61.98,45.72
  Bottom 0.254: v20.07,45.72 22.4,48.06 34.04,48.06 | 34.04,48.06 48.01,48.06 | v61.98,45.72 59.44,45.72 57.1,48.06 48.01,48.06 | v48.01,45.72 48.01,48.06 | v34.04,45.72 34.04,48.06
ROW2  (via drill 0.6)
  Top 0.254: U1.4 U1.P$4 10.16,48.93 8.64,47.4 8.64,42.93 13.46,38.1 80.01,38.1 81.28,39.37 81.28,44.2 v79.76,45.72 D5.C | D7.C v107.7,45.72 | D6.C v93.73,45.72 | D8.C v121.67,45.72 | D18.C 142.75,45.72 143.51,46.48 v143.51,46.99
  Bottom 0.254: v79.76,45.72 81.03,46.99 93.73,46.99 | 93.73,46.99 107.7,46.99 | 107.7,46.99 121.67,46.99 | v107.7,45.72 107.7,46.99 | v93.73,45.72 93.73,46.99 | v121.67,45.72 121.67,46.99 | 121.67,46.99 v143.51,46.99
ROW3  (via drill 0.6)
  Top 0.254: v21.34,27.69 20.32,26.67 12.57,26.67 5.08,34.16 U1.P$2 U1.2 | D9.C v20.32,21.59 22.1,23.37 32.51,23.37 | 32.51,23.37 46.48,23.37 | 46.48,23.37 57.91,23.37 59.05,22.23 D12.C | D11.C 46.35,23.24 46.48,23.37 | D10.C 32.38,23.24 32.51,23.37
  Bottom 0.254: v21.34,27.69 21.34,22.61 v20.32,21.59
ROW4  (via drill 0.6)
  Top 0.254: U1.P$1 U1.1 2.54,34.92 11.94,25.53 76.07,25.53 78.1,23.5 D13.C v79.7,21.59 | D14.C v93.98,21.59 | D15.C v107.7,21.59 | D16.C v121.92,21.59 | D17.C v143.51,21.59
  Bottom 0.254: v79.7,21.59 80.97,22.86 93.98,22.86 | 120.63,21.61 119.38,22.86 107.7,22.86 | 93.98,22.86 107.7,22.86 | 120.63,21.61 120.63,10.49 123.02,8.11 127.49,8.11 140.97,21.59 v143.51,21.59 | v107.7,21.59 107.7,22.86 | v93.98,21.59 93.98,22.86 | v121.92,21.59 120.65,21.59 120.63,21.61
SW0
  Top 0.203: U1.P$34 U1.34 | 99.62,56.97 S1.4
  Top 0.254: U1.34 17.78,71.12 23.75,65.15 33.02,65.15 91.44,65.15 99.62,56.97
VBUS
  Top 0.254: U1.P$40 U1.40
VSYS
  Top 0.254: U1.P$39 U1.39

### Text on the board
tPlace: SELECT | Gnd | 3V3 | SCK | MOSI | RES | DC | CS | PICOSTEPSEQ16 | MIDI OUT | @todbot | MODE | MIDI IN | 1 | 2 | 3 | 4 | 5 | 6 | 7 | 8 | EDIT | 9 | 10 | 11 | 12 | 13 | 14 | 15 | 16 | PLAY
bPlace: picostepseq_mk2_16 10Mar2023 | Gnd | 3V3 | SCK | MOSI | RES | DC | CS | github.com/todbot/picostepseq | Parts: | OUT | U1: Raspberry Pi Pico / U2: H11L1S / U3,U4,U5,U6,U7,U8: WS2811 / DISP: SPI OLED 128x64 1.3" / SW1-SW18: adafruit 5502 / Switronic MP86A1R1H / D1-D19: 1N4148 SOD123 / J1, J2: PJ320D / R9-R18: 1k / R1:33, R2:10, R3:220, C1: 100n | Pico Step Seq | Step Sequencer for USB MIDI & Serial MIDI | MIDI / TRS-A | IN